# Altium schematic sheet Temperature_Sensors.SchDoc
size A4
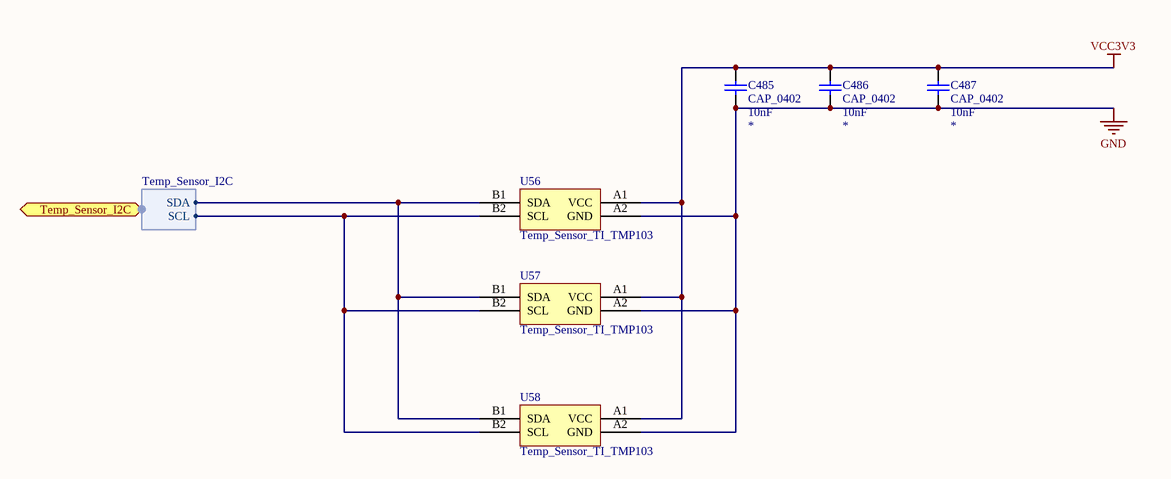
[diagram p0: Temperature_Sensors.SchDoc]

## Parts
C485  CAP_0402  value 10nF  [CAPC0402(1005)60_N]
C486  CAP_0402  value 10nF  [CAPC0402(1005)60_N]
C487  CAP_0402  value 10nF  [CAPC0402(1005)60_N]
U56  Temp_Sensor_TI_TMP103  [Temp_Sensor_TI_TMP103_XBGA-4]
U57  Temp_Sensor_TI_TMP103  [Temp_Sensor_TI_TMP103_XBGA-4]
U58  Temp_Sensor_TI_TMP103  [Temp_Sensor_TI_TMP103_XBGA-4]

## Ports
Temp_Sensor_I2C (harness Temp_Sensor_I2C)

## Harnesses
Temp_Sensor_I2C: SCL, SDA

## Nets
GND: C485.1 C486.1 C487.1 U56.A2(GND) U57.A2(GND) U58.A2(GND)
VCC3V3: C485.2 C486.2 C487.2 U56.A1(VCC) U57.A1(VCC) U58.A1(VCC)
NetU56_B1: U56.B1(SDA) U57.B1(SDA) U58.B1(SDA) ; port Temp_Sensor_I2C.SDA
NetU56_B2: U56.B2(SCL) U57.B2(SCL) U58.B2(SCL) ; port Temp_Sensor_I2C.SCL

## Library data of the parts
C485-C487 = GRM155R60J103KA01D: 10000pF, ceramic, 10% 6.3V X5R, 0402; Manufacturer: Murata Electronics North America; Tolerance: *; Part Number: GRM155R60J103KA01D
U56 = TMP103AYFFR: IC TEMP SENSOR DGTL SMBUS 4DSBGA, Address - A; Manufacturer: Texas Instruments; Part Number: TMP103AYFFR
U57 = TMP103BYFFR: IC TEMP SENSOR DGTL SMBUS 4DSBGA, Address - B; Manufacturer: Texas Instruments; Part Number: TMP103BYFFR
U58 = TMP103CYFFR: IC TEMP SENSOR DGTL SMBUS 4DSBGA, Address - C; Manufacturer: Texas Instruments; Part Number: TMP103CYFFR